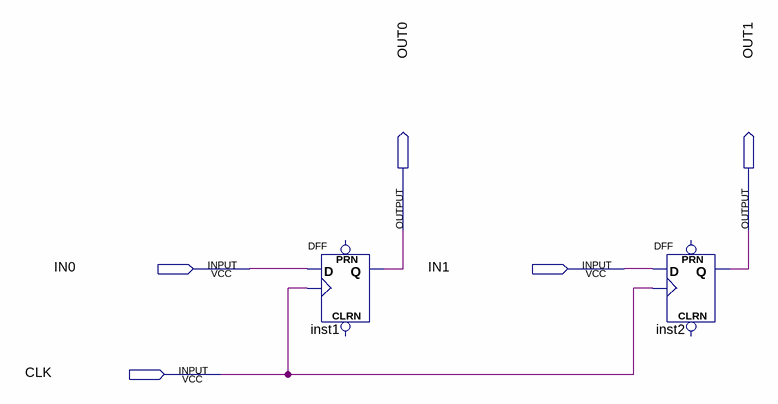
[diagram p0: schematic sheet]
// Quartus schematic resclk.bdf as structural Verilog: 2 symbols, 5 pins
module resclk (
  input  IN0,
  input  IN1,
  input  CLK,
  output OUT0,
  output OUT1
);

  DFF inst1 (.CLK(CLK), .D(IN0), .Q(OUT0));  // open: CLRN, PRN
  DFF inst2 (.CLK(CLK), .D(IN1), .Q(OUT1));  // open: CLRN, PRN
endmodule
